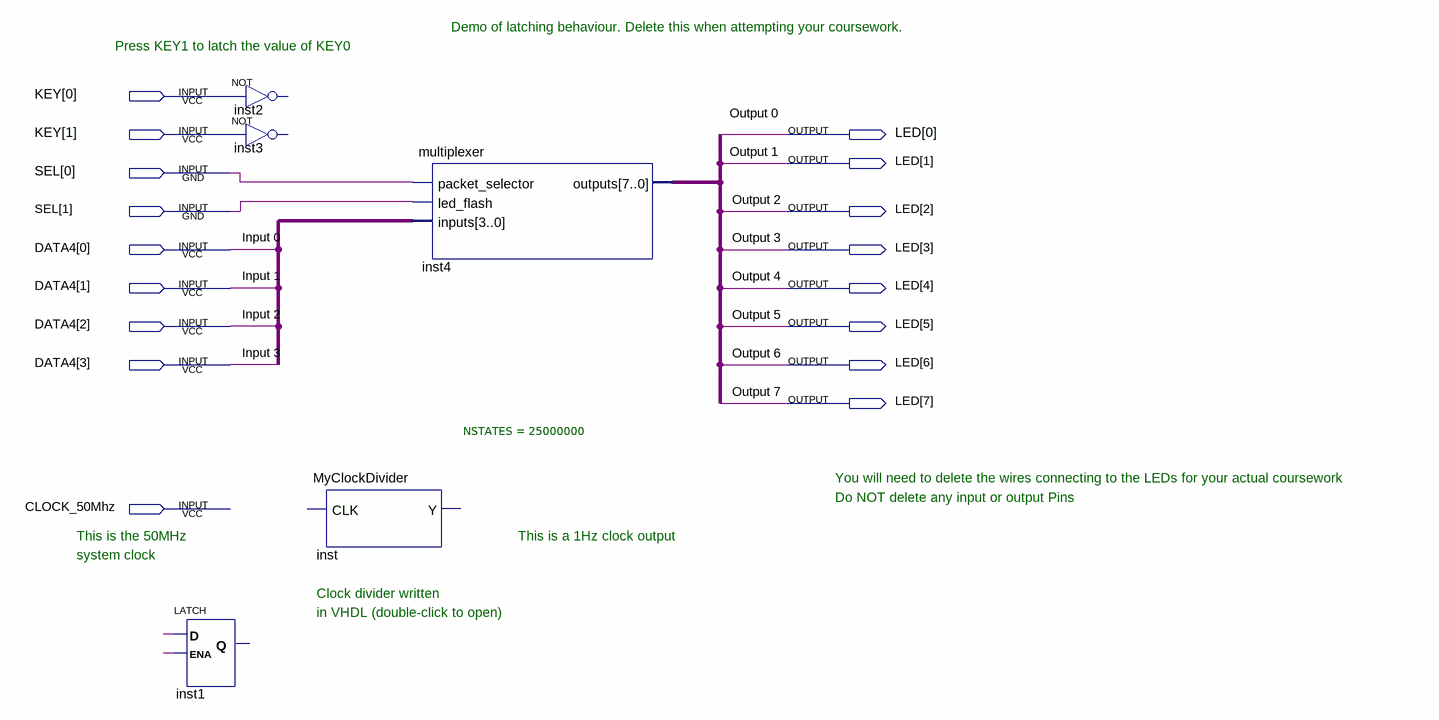
[diagram p0: schematic sheet]
// Quartus schematic Template_2019.bdf as structural Verilog: 5 symbols, 17 pins
module Template_2019 (
  input  [1:0] KEY,
  input  [1:0] SEL,
  input  [3:0] DATA4,
  input  CLOCK_50Mhz,
  output [7:0] LED
);

  wire undriven, undriven_2;
  wire [3:0] undriven_3;
  wire [7:0] inst4_outputs;

  LATCH inst1 (.D(undriven), .ENA(undriven_2));  // open: Q
  // NOT inst2 has open pins: IN=KEY[0], OUT=open
  // NOT inst3 has open pins: IN=KEY[1], OUT=open
  MyClockDivider #(.NSTATES(25000000)) inst ();  // open: CLK, Y
  multiplexer inst4 (.packet_selector(SEL[0]), .led_flash(SEL[1]), .inputs(undriven_3), .outputs(inst4_outputs));

  // Other names for the same wires on the sheet: Input 0 = DATA4[0]; Input 1 = DATA4[1]; Input 2 = DATA4[2];
  //   Input 3 = DATA4[3]; Output 0 = LED[0]; Output 1 = LED[1]; Output 2 = LED[2]; Output 3 = LED[3];
  //   Output 4 = LED[4]; Output 5 = LED[5]; Output 6 = LED[6]; Output 7 = LED[7]

  // Notes on the sheet:
  //   Demo of latching behaviour. Delete this when attempting your coursework.
  //   Press KEY1 to latch the value of KEY0
  //   You will need to delete the wires connecting to the LEDs for your actual coursework
  //   Do NOT delete any input or output Pins
  //   This is the 50MHz
  //   This is a 1Hz clock output
  //   system clock
  //   Clock divider written
  //   in VHDL (double-click to open)
endmodule
